# Altium schematic sheet MotorCtrlSystemDiag.SchDoc
size Letter
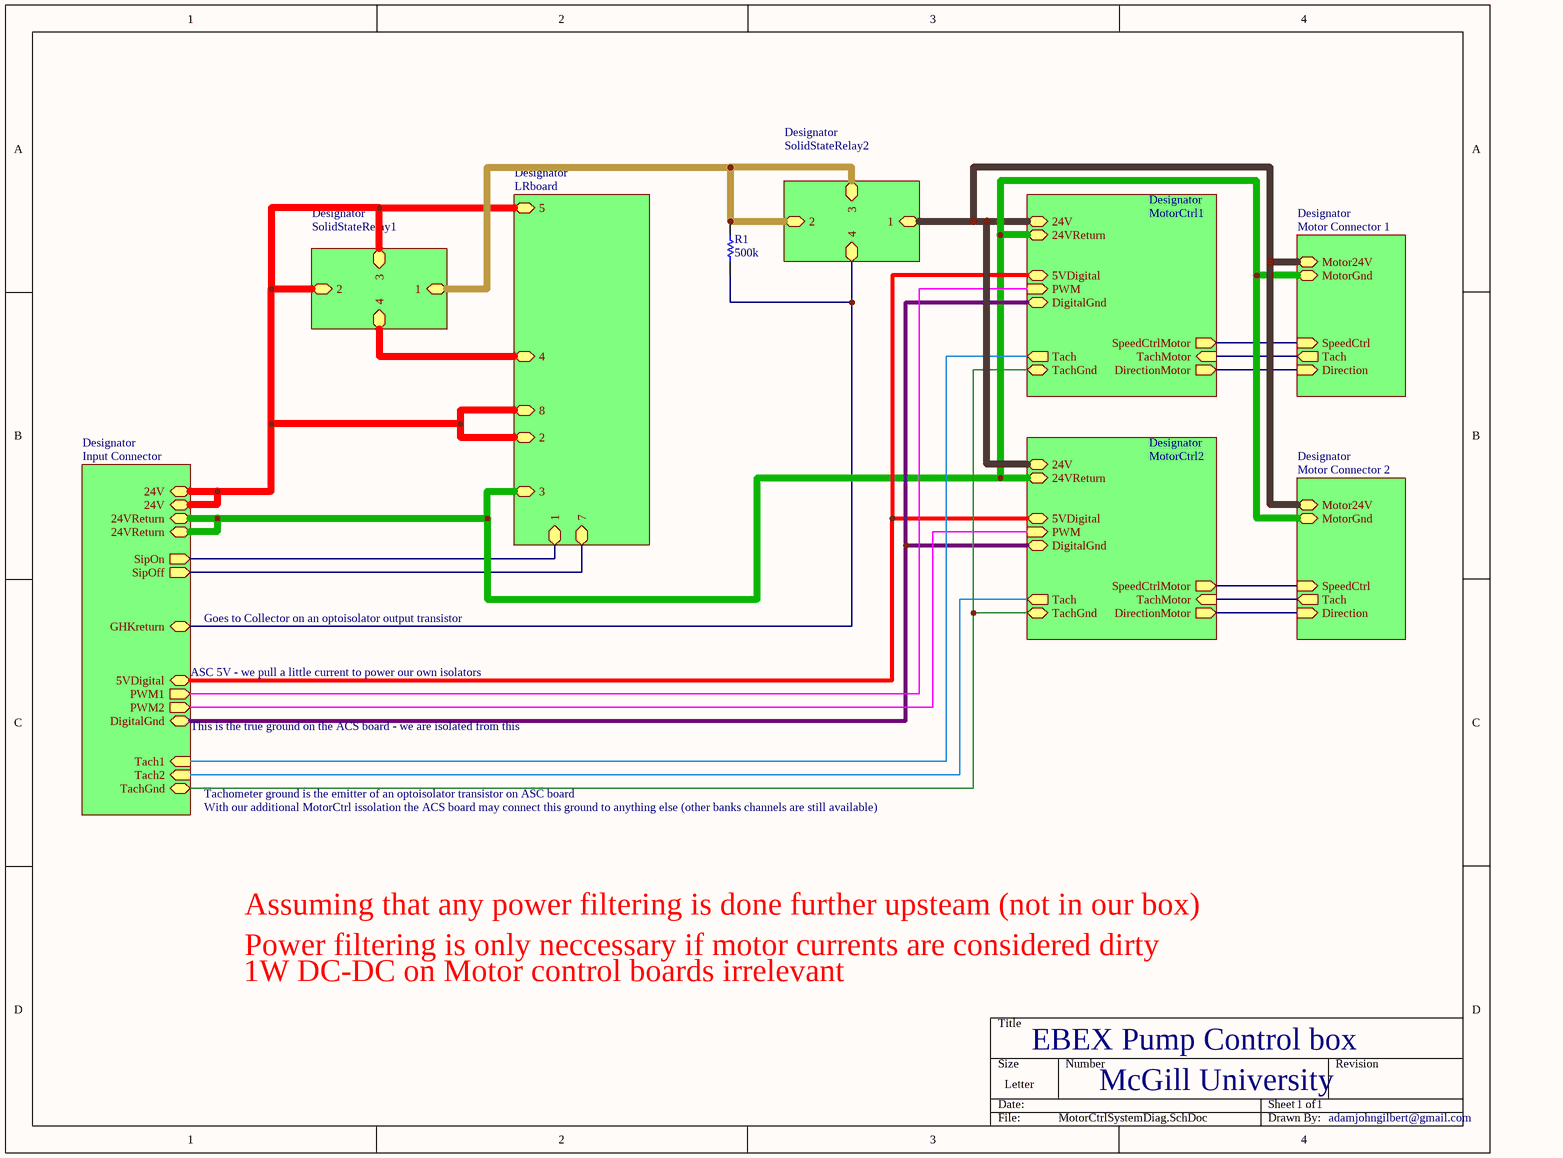
[diagram p0: MotorCtrlSystemDiag.SchDoc]

## Parts
R1  value 500k  [0603]  (hidden comment: Res0603)

## Sub-sheets
Designator = Input Connector: 5VDigital, DigitalGnd, PWM1 (out), PWM2 (out), Tach2 (in), Tach1 (in), TachGnd, GHKreturn, 24V, 24VReturn, SipOn (out), SipOff (out), 24V, 24VReturn
Designator = Motor Connector 1: Motor24V, MotorGnd, SpeedCtrl (in), Tach (out), Direction (in)
Designator = MotorCtrl1: 5VDigital, DigitalGnd, PWM (in), TachMotor (in), Tach (out), TachGnd, DirectionMotor (out), 24V, 24VReturn, SpeedCtrlMotor (out)
Designator = Motor Connector 2: Motor24V, MotorGnd, SpeedCtrl (in), Tach (out), Direction (in)
Designator = MotorCtrl2: 5VDigital, DigitalGnd, PWM (in), TachMotor (in), Tach (out), TachGnd, DirectionMotor (out), 24V, 24VReturn, SpeedCtrlMotor (out)
Designator = SolidStateRelay1: 2, 1, 3, 4
Designator = SolidStateRelay2: 2, 1, 3, 4
Designator = LRboard: 5, 1, 3, 7, 4, 8, 2

## Nets
NetR1_1: R1.1 ; sheet Designator/GHKreturn, sheet Designator/4
NetR1_2: R1.2 ; sheet Designator/1, sheet Designator/2, sheet Designator/3
(unnamed): sheet Designator/5VDigital, sheet Designator/5VDigital, sheet Designator/5VDigital
(unnamed): sheet Designator/DigitalGnd, sheet Designator/DigitalGnd, sheet Designator/DigitalGnd
(unnamed): sheet Designator/PWM1, sheet Designator/PWM
(unnamed): sheet Designator/PWM2, sheet Designator/PWM
(unnamed): sheet Designator/Tach2, sheet Designator/Tach
(unnamed): sheet Designator/Tach1, sheet Designator/Tach
(unnamed): sheet Designator/TachGnd, sheet Designator/TachGnd, sheet Designator/TachGnd
(unnamed): sheet Designator/24V, sheet Designator/24V, sheet Designator/2, sheet Designator/3, sheet Designator/5, sheet Designator/8, sheet Designator/2
(unnamed): sheet Designator/24VReturn, sheet Designator/24VReturn, sheet Designator/MotorGnd, sheet Designator/24VReturn, sheet Designator/MotorGnd, sheet Designator/24VReturn, sheet Designator/3
(unnamed): sheet Designator/SipOn, sheet Designator/1
(unnamed): sheet Designator/SipOff, sheet Designator/7
(unnamed): sheet Designator/Motor24V, sheet Designator/24V, sheet Designator/Motor24V, sheet Designator/24V, sheet Designator/1
(unnamed): sheet Designator/SpeedCtrl, sheet Designator/SpeedCtrlMotor
(unnamed): sheet Designator/Tach, sheet Designator/TachMotor
(unnamed): sheet Designator/Direction, sheet Designator/DirectionMotor
(unnamed): sheet Designator/SpeedCtrl, sheet Designator/SpeedCtrlMotor
(unnamed): sheet Designator/Tach, sheet Designator/TachMotor
(unnamed): sheet Designator/Direction, sheet Designator/DirectionMotor
(unnamed): sheet Designator/4, sheet Designator/4

## Notes on the sheet
- Goes to Collector on an optoisolator output transistor
- ASC 5V - we pull a little current to power our own isolators
- This is the true ground on the ACS board - we are isolated from this
- Tachometer ground is the emitter of an optoisolator transistor on ASC board
- With our additional MotorCtrl issolation the ACS board may connect this ground to anything else (other banks channels are still available)
- Assuming that any power filtering is done further upsteam (not in our box)
- Power filtering is only neccessary if motor currents are considered dirty
- 1W DC-DC on Motor control boards irrelevant
- EBEX Pump Control box
- McGill University
- 1
- adamjohngilbert@gmail.com

## Library data of the parts
R1 = Res0603: Resistor; Param1: 100ppm/C; Param: 1%; TechInfo: *